# Altium schematic sheet Interface.SchDoc
size D; SheetNumber: 9; SheetTotal: 15
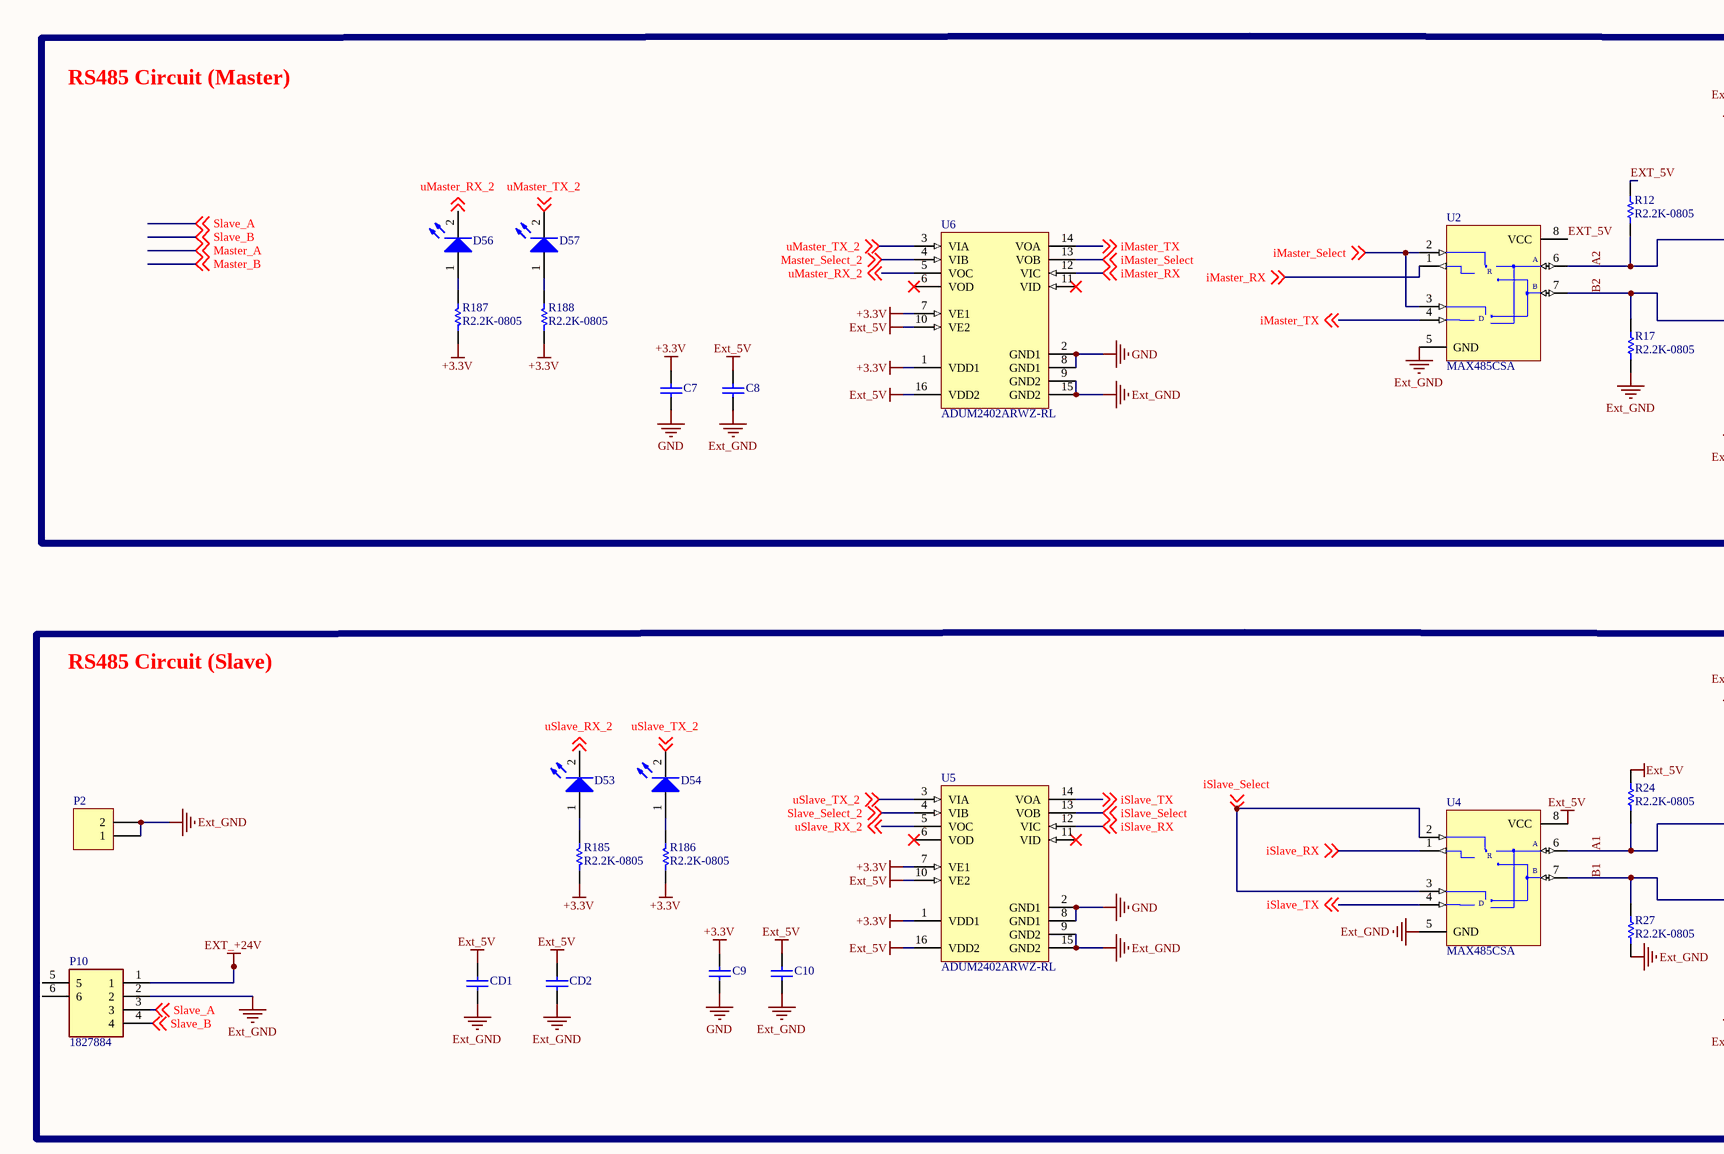
[diagram p0: Interface.SchDoc, top left]
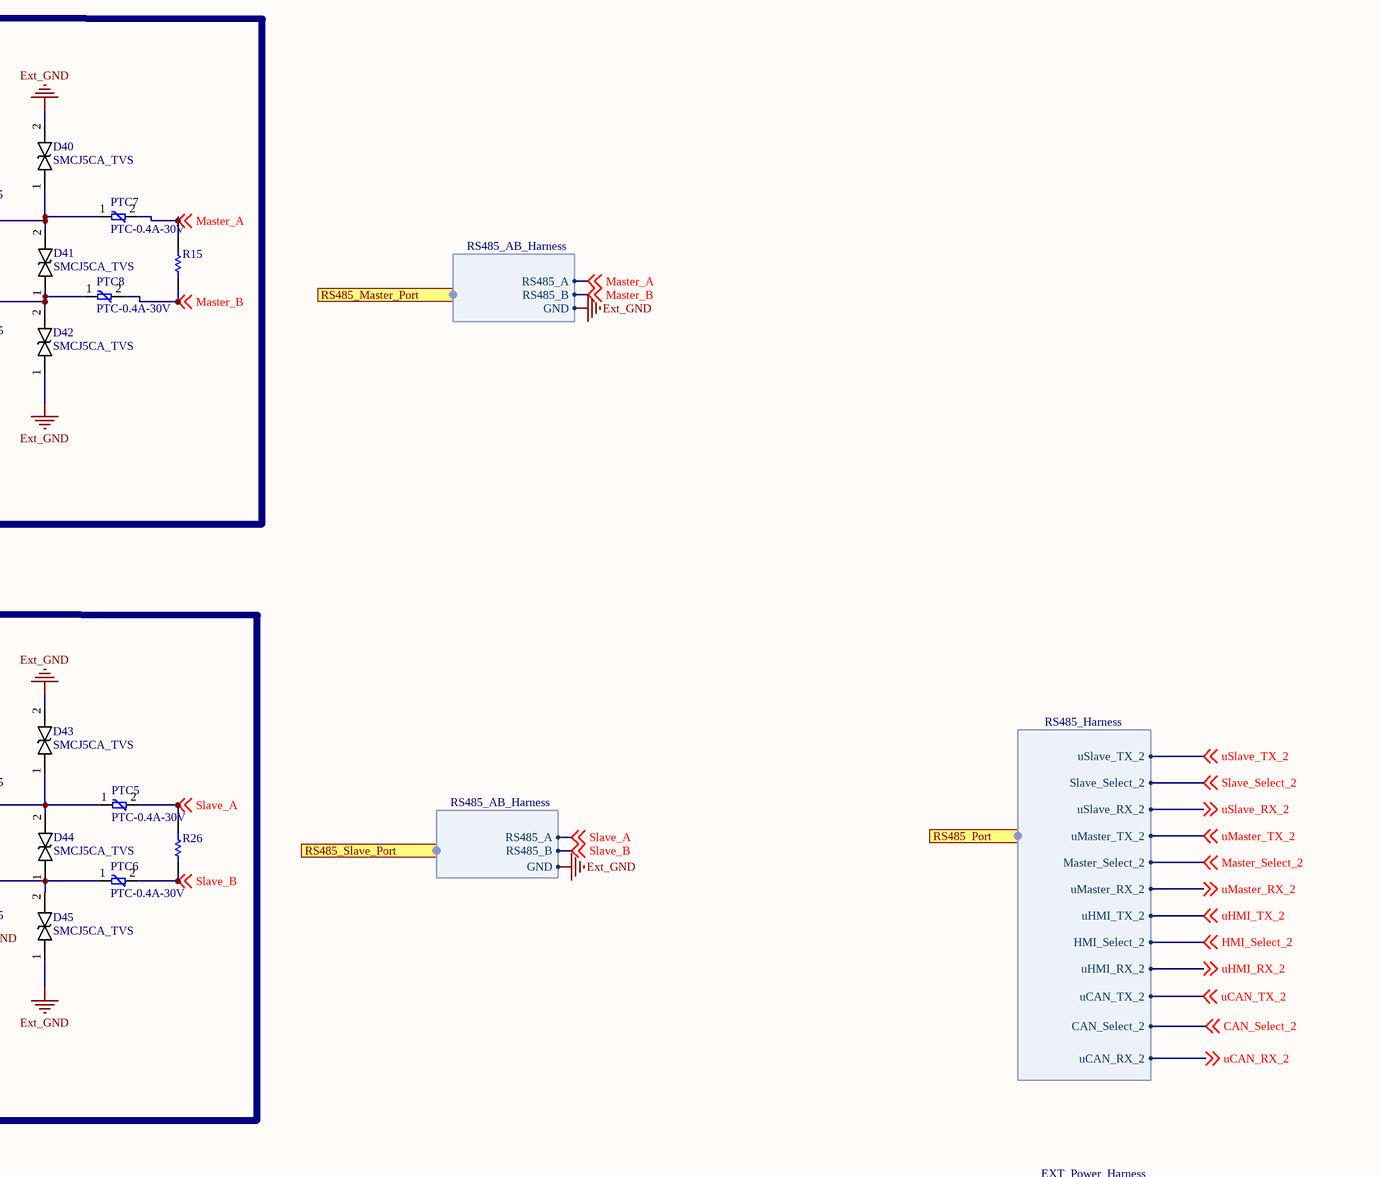
[diagram p1: Interface.SchDoc, top right]
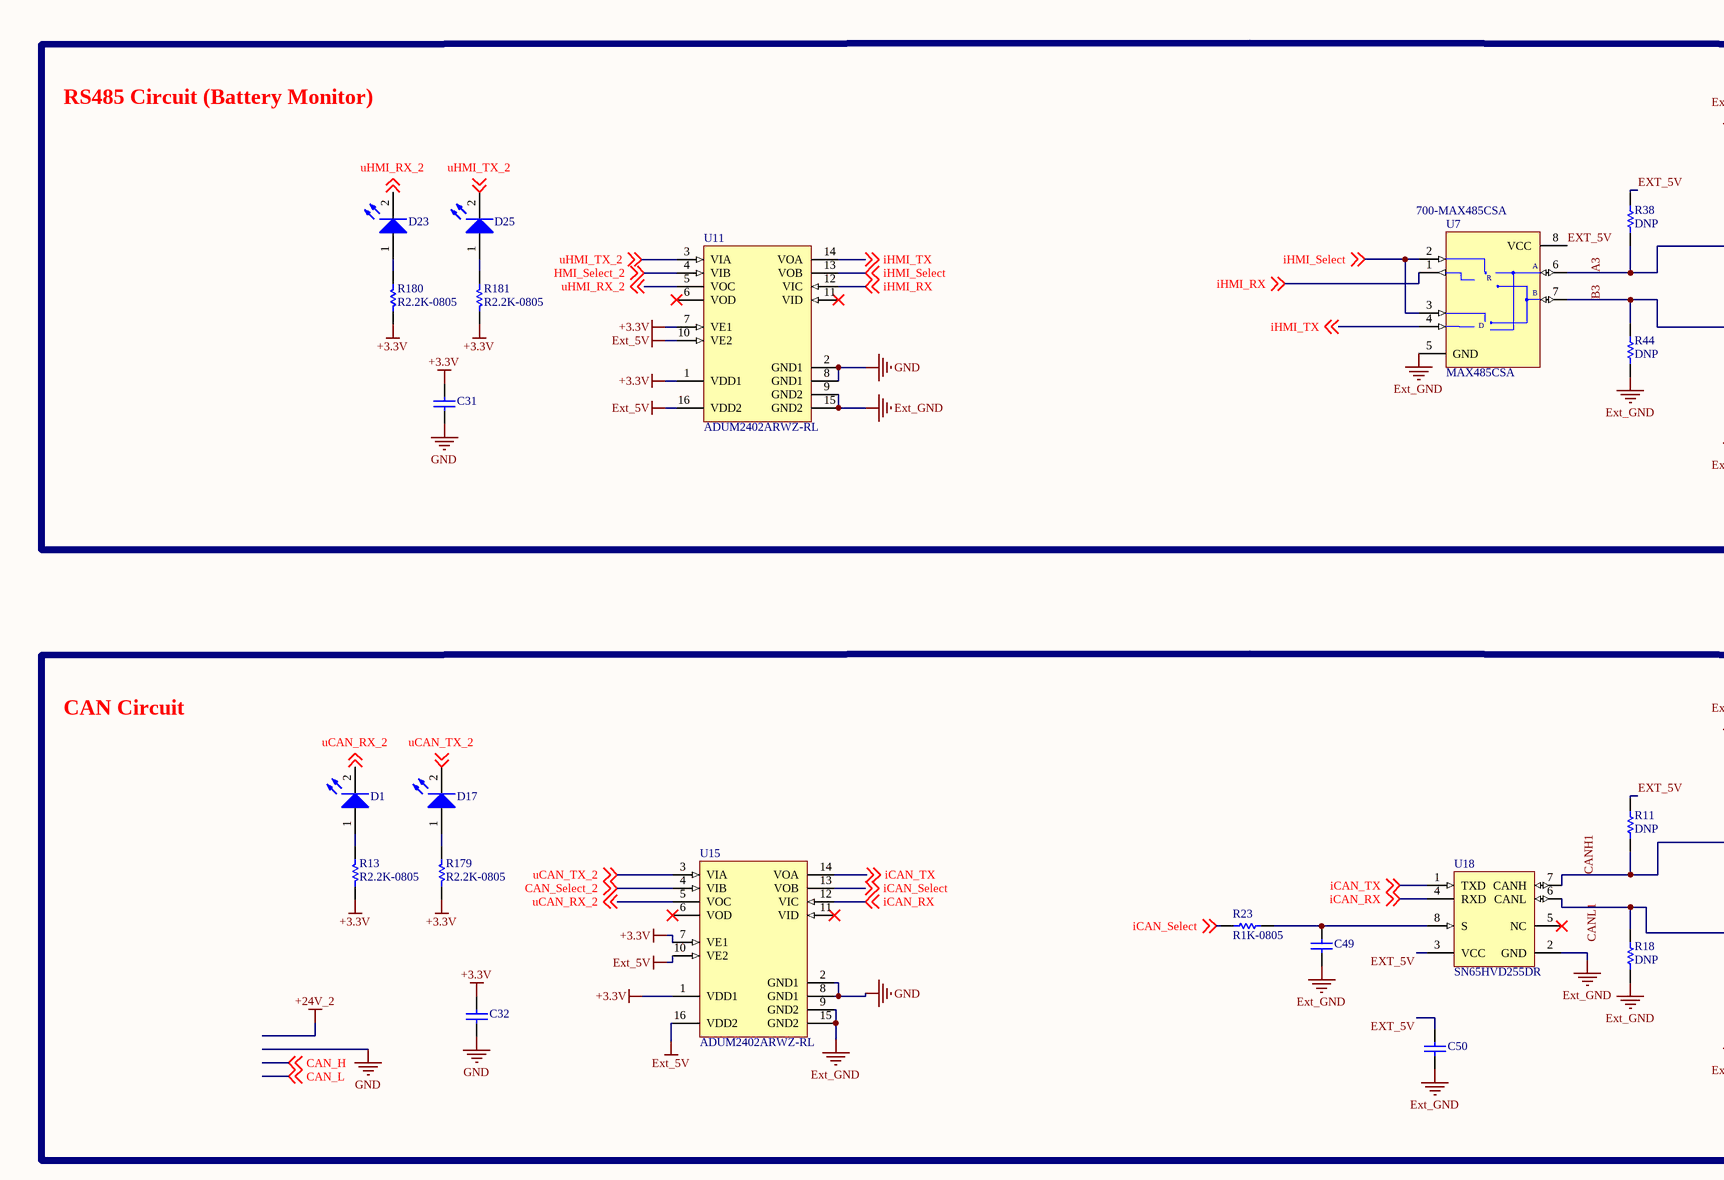
[diagram p2: Interface.SchDoc, bottom left]
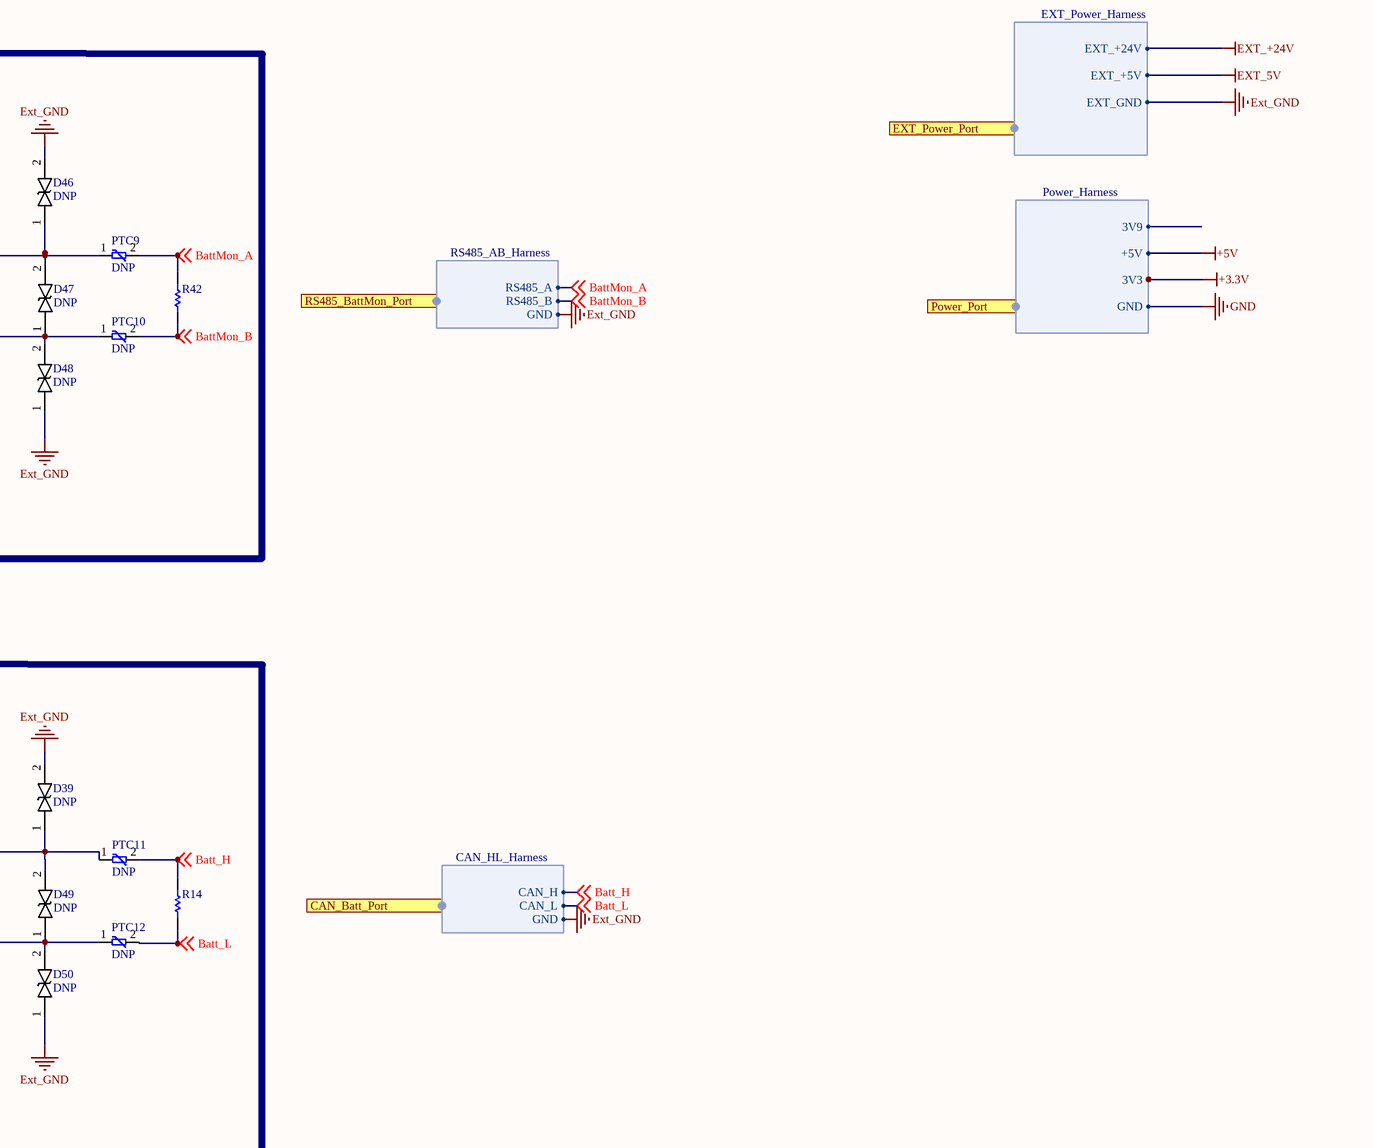
[diagram p3: Interface.SchDoc, bottom right]

## Parts
C7  (no value)  [CRF06031]
C8  (no value)  [CRF06031]
C9  (no value)  [CRF06031]
C10  (no value)  [CRF06031]
C31  (no value)  [CRF06031]
C32  (no value)  [CRF06031]
C49  (no value)  [CRF06031]
C50  (no value)  [CRF06031]
CD1  (no value)  [CRF06031]
CD2  (no value)  [CRF06031]
D1  LED_0805_green  [0805-LED]  (value not drawn)
D17  LED_0805_green  [0805-LED]  (value not drawn)
D23  LED_0805_green  [0805-LED]  (value not drawn)
D25  LED_0805_green  [0805-LED]  (value not drawn)
D39  DNP  [DO-214AC(SMA)]
D40  SMCJ5CA_TVS  [DO-214AC(SMA)]
D41  SMCJ5CA_TVS  [DO-214AC(SMA)]
D42  SMCJ5CA_TVS  [DO-214AC(SMA)]
D43  SMCJ5CA_TVS  [DO-214AC(SMA)]
D44  SMCJ5CA_TVS  [DO-214AC(SMA)]
D45  SMCJ5CA_TVS  [DO-214AC(SMA)]
D46  DNP  [DO-214AC(SMA)]
D47  DNP  [DO-214AC(SMA)]
D48  DNP  [DO-214AC(SMA)]
D49  DNP  [DO-214AC(SMA)]
D50  DNP  [DO-214AC(SMA)]
D53  LED_0805_green  [0805-LED]  (value not drawn)
D54  LED_0805_green  [0805-LED]  (value not drawn)
D56  LED_0805_green  [0805-LED]  (value not drawn)
D57  LED_0805_green  [0805-LED]  (value not drawn)
P2  DNP  [HDR1X2]  (value not drawn)
P10  1827884  [1827884]
PTC5  PTC-0.4A-30V  [CRF1206]
PTC6  PTC-0.4A-30V  [CRF1206]
PTC7  PTC-0.4A-30V  [CRF1206]
PTC8  PTC-0.4A-30V  [CRF1206]
PTC9  DNP  [CRF1206]
PTC10  DNP  [CRF1206]
PTC11  DNP  [CRF1206]
PTC12  DNP  [CRF1206]
R11  DNP  [CRF06031]
R12  R2.2K-0805  [CRF06031]
R13  R2.2K-0805  [CRF06031]
R14  DNP  [CRF06031]  (value not drawn)
R15  R2.2k-0805  [CRF06031]  (value not drawn)
R17  R2.2K-0805  [CRF06031]
R18  DNP  [CRF06031]
R23  R1K-0805  [CRF06031]
R24  R2.2K-0805  [CRF06031]
R26  R2.2k-0805  [CRF06031]  (value not drawn)
R27  R2.2K-0805  [CRF06031]
R38  DNP  [CRF06031]
R42  DNP  [CRF06031]  (value not drawn)
R44  DNP  [CRF06031]
R179  R2.2K-0805  [CRF06031]
R180  R2.2K-0805  [CRF06031]
R181  R2.2K-0805  [CRF06031]
R185  R2.2K-0805  [CRF06031]
R186  R2.2K-0805  [CRF06031]
R187  R2.2K-0805  [CRF06031]
R188  R2.2K-0805  [CRF06031]
U2  MAX485CSA  [SO8_N]
U4  MAX485CSA  [SO8_N]
U5  ADUM2402ARWZ-RL  [ADI-RW-16_L]
U6  ADUM2402ARWZ-RL  [ADI-RW-16_L]
U7  MAX485CSA  Supplier Part Number 1: 700-MAX485CSA  [SO8_N]
U11  ADUM2402ARWZ-RL  [ADI-RW-16_L]
U15  ADUM2402ARWZ-RL  [ADI-RW-16_L]
U18  SN65HVD255DR  [D0008A_L]

## Ports
CAN_Batt_Port (harness CAN_HL_Harness), EXT_Power_Port (harness EXT_Power_Harness), Power_Port (harness Power_Harness), RS485  Port (harness RS485_Harness), RS485_BattMon_Port (harness RS485_AB_Harness), RS485_Master_Port (harness RS485_AB_Harness), RS485_Slave_Port (harness RS485_AB_Harness)

## Harnesses
RS485_Harness: uSlave_TX_2, Slave_Select_2, uSlave_RX_2, uMaster_TX_2, Master_Select_2, uMaster_RX_2, uHMI_TX_2, HMI_Select_2, uHMI_RX_2, uCAN_TX_2, CAN_Select_2, uCAN_RX_2
Power_Harness: 3V9, +5V, 3V3, GND
EXT_Power_Harness: EXT_+24V, EXT_+5V, EXT_GND
RS485_AB_Harness: RS485_A, RS485_B, GND
CAN_HL_Harness: CAN_H, CAN_L, GND

## Nets
+3.3V: C7.2 C9.2 C31.2 C32.2 R13.2 R179.2 R180.2 R181.2 R185.2 R186.2 R187.2 R188.2 U5.1(VDD1) U5.7(VE1) U6.1(VDD1) U6.7(VE1) U11.1(VDD1) U11.7(VE1) U15.1(VDD1) U15.7(VE1) ; port Power_Port.3V3
+5V: port Power_Port.+5V
EXT_5V: C8.2 C10.2 C50.2 CD1.2 CD2.2 R11.1 R12.1 R24.1 R38.1 U2.8(VCC) U4.8(VCC) U5.10(VE2) U5.16(VDD2) U6.10(VE2) U6.16(VDD2) U7.8(VCC) U11.10(VE2) U11.16(VDD2) U15.10(VE2) U15.16(VDD2) U18.3(VCC) ; port EXT_Power_Port.EXT_+5V
EXT_+24V: P10.1 ; port EXT_Power_Port.EXT_+24V
Ext_GND: C8.1 C10.1 C49.2 C50.1 CD1.1 CD2.1 D39.2(C) D40.2(C) D42.1(A) D43.2(C) D45.1(A) D46.2(C) D48.1(A) D50.1(A) P2.1 P2.2 P10.2 R17.2 R18.2 R27.2 R44.2 U2.5(GND) U4.5(GND) U5.9(GND2) U5.15(GND2) U6.9(GND2) U6.15(GND2) U7.5(GND) U11.9(GND2) U11.15(GND2) U15.9(GND2) U15.15(GND2) U18.2(GND) ; port EXT_Power_Port.EXT_GND, port RS485_Master_Port.GND, port RS485_Slave_Port.GND, port RS485_BattMon_Port.GND, port CAN_Batt_Port.GND
GND: C7.1 C9.1 C31.1 C32.1 U5.2(GND1) U5.8(GND1) U6.2(GND1) U6.8(GND1) U11.2(GND1) U11.8(GND1) U15.2(GND1) U15.8(GND1) ; port Power_Port.GND
A1: D43.1(A) D44.2(C) PTC5.1 R24.2 U4.6(A)
A2: D40.1(A) D41.2(C) PTC7.1 R12.2 U2.6(A)
A3: D46.1(A) D47.2(C) PTC9.1 R38.2 U7.6(A)
B1: D44.1(A) D45.2(C) PTC6.1 R27.1 U4.7(B)
B2: D41.1(A) D42.2(C) PTC8.1 R17.1 U2.7(B)
B3: D47.1(A) D48.2(C) PTC10.1 R44.1 U7.7(B)
Batt_H: PTC11.2 R14.1 ; off-sheet Batt_H, port CAN_Batt_Port.CAN_H
Batt_L: PTC12.2 R14.2 ; off-sheet Batt_L, port CAN_Batt_Port.CAN_L
BattMon_A: PTC9.2 R42.1 ; off-sheet BattMon_A, port RS485_BattMon_Port.RS485_A
BattMon_B: PTC10.2 R42.2 ; off-sheet BattMon_B, port RS485_BattMon_Port.RS485_B
CAN_Select_2: U15.4(VIB) ; off-sheet CAN_Select_2, port RS485  Port.CAN_Select_2
CANH1: D39.1(A) D49.2(C) PTC11.1 R11.2 U18.7(CANH)
HMI_Select_2: U11.4(VIB) ; off-sheet HMI_Select_2, port RS485  Port.HMI_Select_2
iCAN_RX: U15.12(VIC) U18.4(RXD) ; off-sheet iCAN_RX
iCAN_Select: R23.1 U15.13(VOB) ; off-sheet iCAN_Select
iCAN_TX: U15.14(VOA) U18.1(TXD) ; off-sheet iCAN_TX
iHMI_RX: U7.1(RO) U11.12(VIC) ; off-sheet iHMI_RX
iHMI_Select: U7.2(~{RE}) U7.3(DE) U11.13(VOB) ; off-sheet iHMI_Select
iHMI_TX: U7.4(DI) U11.14(VOA) ; off-sheet iHMI_TX
iMaster_RX: U2.1(RO) U6.12(VIC) ; off-sheet iMaster_RX
iMaster_Select: U2.2(~{RE}) U2.3(DE) U6.13(VOB) ; off-sheet iMaster_Select
iMaster_TX: U2.4(DI) U6.14(VOA) ; off-sheet iMaster_TX
iSlave_RX: U4.1(RO) U5.12(VIC) ; off-sheet iSlave_RX
iSlave_Select: U4.2(~{RE}) U4.3(DE) U5.13(VOB) ; off-sheet iSlave_Select
iSlave_TX: U4.4(DI) U5.14(VOA) ; off-sheet iSlave_TX
Master_A: PTC7.2 R15.1 ; off-sheet Master_A, port RS485_Master_Port.RS485_A
Master_B: PTC8.2 R15.2 ; off-sheet Master_B, port RS485_Master_Port.RS485_B
Master_Select_2: U6.4(VIB) ; off-sheet Master_Select_2, port RS485  Port.Master_Select_2
Slave_A: P10.3 PTC5.2 R26.1 ; off-sheet Slave_A, port RS485_Slave_Port.RS485_A
Slave_B: P10.4 PTC6.2 R26.2 ; off-sheet Slave_B, port RS485_Slave_Port.RS485_B
Slave_Select_2: U5.4(VIB) ; off-sheet Slave_Select_2, port RS485  Port.Slave_Select_2
uCAN_RX_2: D1.2(K) U15.5(VOC) ; off-sheet uCAN_RX_2, port RS485  Port.uCAN_RX_2
uCAN_TX_2: D17.2(K) U15.3(VIA) ; off-sheet uCAN_TX_2, port RS485  Port.uCAN_TX_2
uHMI_RX_2: D23.2(K) U11.5(VOC) ; off-sheet uHMI_RX_2, port RS485  Port.uHMI_RX_2
uHMI_TX_2: D25.2(K) U11.3(VIA) ; off-sheet uHMI_TX_2, port RS485  Port.uHMI_TX_2
uMaster_RX_2: D56.2(K) U6.5(VOC) ; off-sheet uMaster_RX_2, port RS485  Port.uMaster_RX_2
uMaster_TX_2: D57.2(K) U6.3(VIA) ; off-sheet uMaster_TX_2, port RS485  Port.uMaster_TX_2
uSlave_RX_2: D53.2(K) U5.5(VOC) ; off-sheet uSlave_RX_2, port RS485  Port.uSlave_RX_2
uSlave_TX_2: D54.2(K) U5.3(VIA) ; off-sheet uSlave_TX_2, port RS485  Port.uSlave_TX_2
NetC49_1: C49.1 R23.2 U18.8(S)
NetD1_1: D1.1(A) R13.1
NetD17_1: D17.1(A) R179.1
NetD23_1: D23.1(A) R180.1
NetD25_1: D25.1(A) R181.1
NetD49_1: D49.1(A) D50.2(C) PTC12.1 R18.1 U18.6(CANL)
NetD53_1: D53.1(A) R185.1
NetD54_1: D54.1(A) R186.1
NetD56_1: D56.1(A) R187.1
NetD57_1: D57.1(A) R188.1

Not connected (* = marked no-connect by the designer): P10 5 6; U5 6(VOD)* 11(VID)*; U6 6(VOD)* 11(VID)*; U11 6(VOD)* 11(VID)*; U15 6(VOD)* 11(VID)*; U18 5(NC)*

## Notes on the sheet
- RS485 Circuit (Master)
- RS485 Circuit (Slave)
- RS485 Circuit (Battery Monitor)
- CAN Circuit
- Labels drawn without touching a wire or pin: CANL1
- (in symbol MAX485CSA) R; D

## Library data of the parts
C7-C10 C31 C32 C50 CD1 CD2 = Cap: Capacitor; Manufacturer_P/N: GCM21BR72A104KA37L; Digi-Key_Part_Number: 490-4789-1-ND; JLC P/N: C85866
  C7 C8: ClassName: RS485_Master
  C9 C10: ClassName: RS485_Slave
  C31: ClassName: RS485_BatMonitor
  C32 C50: ClassName: CAN_Bat
C49 = Cap: Capacitor; Manufacturer_P/N: GRM2165C2A102JA01D; ClassName: CAN_Bat; Digi-Key_Part_Number: 490-6445-2-ND; JLC P/N: C162289
D1 D17 D23 D25 D53 D54 D56 D57 = LED_0805: Manufacturer_P/N: NCD0805R1; JLC P/N: C84256
  D1 D17: ClassName: CAN_Bat
D39-D50 = SMCJ36CA_TVS: Manufacturer_P/N: SMCJ15CA-TR; Digi-Key_Part_Number: 497-6518-2-ND; JLC P/N: C133650
  D39 D49 D50: ClassName: CAN_Bat
  D40-D42: ClassName: RS485_Master
  D43-D45: ClassName: RS485_Slave
  D46-D48: ClassName: RS485_BatMonitor
P2 = Header 2
P10 = 1827884: Connector; Manufacturer_Name: Phoenix Contact; Manufacturer_Part_Number: 1827884; Mouser Part Number: 651-1827884; Arrow Part Number: 1827884; Digi-Key_Part_Number: 277-5791-ND; Manufacturer_P/N: 1827884; JLC P/N: C480609
PTC5-PTC12 = PTC: Manufacturer_P/N: 0ZCJ0005FF2E; Digi-Key_Part_Number: 5923-0ZCJ0005FF2ETR-ND; JLC P/N: C194141
  PTC5 PTC6: ClassName: RS485_Slave
  PTC7 PTC8: ClassName: RS485_Master
  PTC9 PTC10: ClassName: RS485_BatMonitor
  PTC11 PTC12: ClassName: CAN_Bat
R11 R14 R18 R38 R42 R44 = Res1
  R11 R14 R18: ClassName: CAN_Bat
  R38 R42 R44: ClassName: RS485_BatMonitor
R12 R13 R17 R24 R27 R179-R181 R185-R188 = Res1: Resistor; Manufacturer_P/N: RC0805FR-072K2L; Digi-Key_Part_Number: 311-2.20KCRTR-ND; JLC P/N: C114561
  R12 R17: ClassName: RS485_Master
  R13 R179: ClassName: CAN_Bat
  R24 R27: ClassName: RS485_Slave
R15 R26 = Res1: DNP; Manufacturer_P/N: RC0805FR-072K2L; Digi-Key_Part_Number: 311-2.20KCRTR-ND; JLC P/N: C114561
  R15: ClassName: RS485_Master
  R26: ClassName: RS485_Slave
R23 = Res1: Resistor; Manufacturer_P/N: RC0805FR-071KL; ClassName: CAN_Bat; Digi-Key_Part_Number: 311-1.00KCRTR-ND; JLC P/N: C95781
U2 U4 = MAX485CSA: SMD; Manufacturer_P/N: MAX485CSA+; Digi-Key_Part_Number: MAX485CSA+-ND; JLC P/N: C143494
  U2: ClassName: RS485_Master
  U4: ClassName: RS485_Slave
U5 U6 U11 U15 = CMP-0534-00427-1: Quad Channel Digital Isolator, 5 KV rms Insulation Rating, 1 Mbps Data Rate, 100 ns Delay, Industrial, 16-pin SOIC (RW-16), Reel; PartNumber: ADUM2402ARWZ-RL; Digi-Key_Part_Number: 505-ADUM2402ARWZ-RLTR-ND; Manufacturer_P/N: ADUM2402ARWZ-RL; JLC P/N: C406693
  U5: ClassName: RS485_Slave
  U6: ClassName: RS485_Master
  U11: ClassName: RS485_BatMonitor
  U15: ClassName: CAN_Bat
U7 = MAX485CSA: DNP; Manufacturer_P/N: MAX485CSA+; ClassName: RS485_BatMonitor; Digi-Key_Part_Number: MAX485CSA+-ND; Supplier 1: Mouser; JLC P/N: C143494
U18 = CMP-0315-00057-2: CAN Transceiver with Fast Loop Times for Highly Loaded Networks, 85 mA, 5 V, -40 to 125 degC, 8-pin SOIC (D), Green (RoHS & no Sb/Br); Footprint: TJA1051T, PCA82C251, TJA1050; PartNumber: SN65HVD255DR; ClassName: CAN_Bat; Digi-Key_Part_Number: 296-30092-2-ND; Manufacturer_P/N: SN65HVD255DR; JLC P/N: C132552